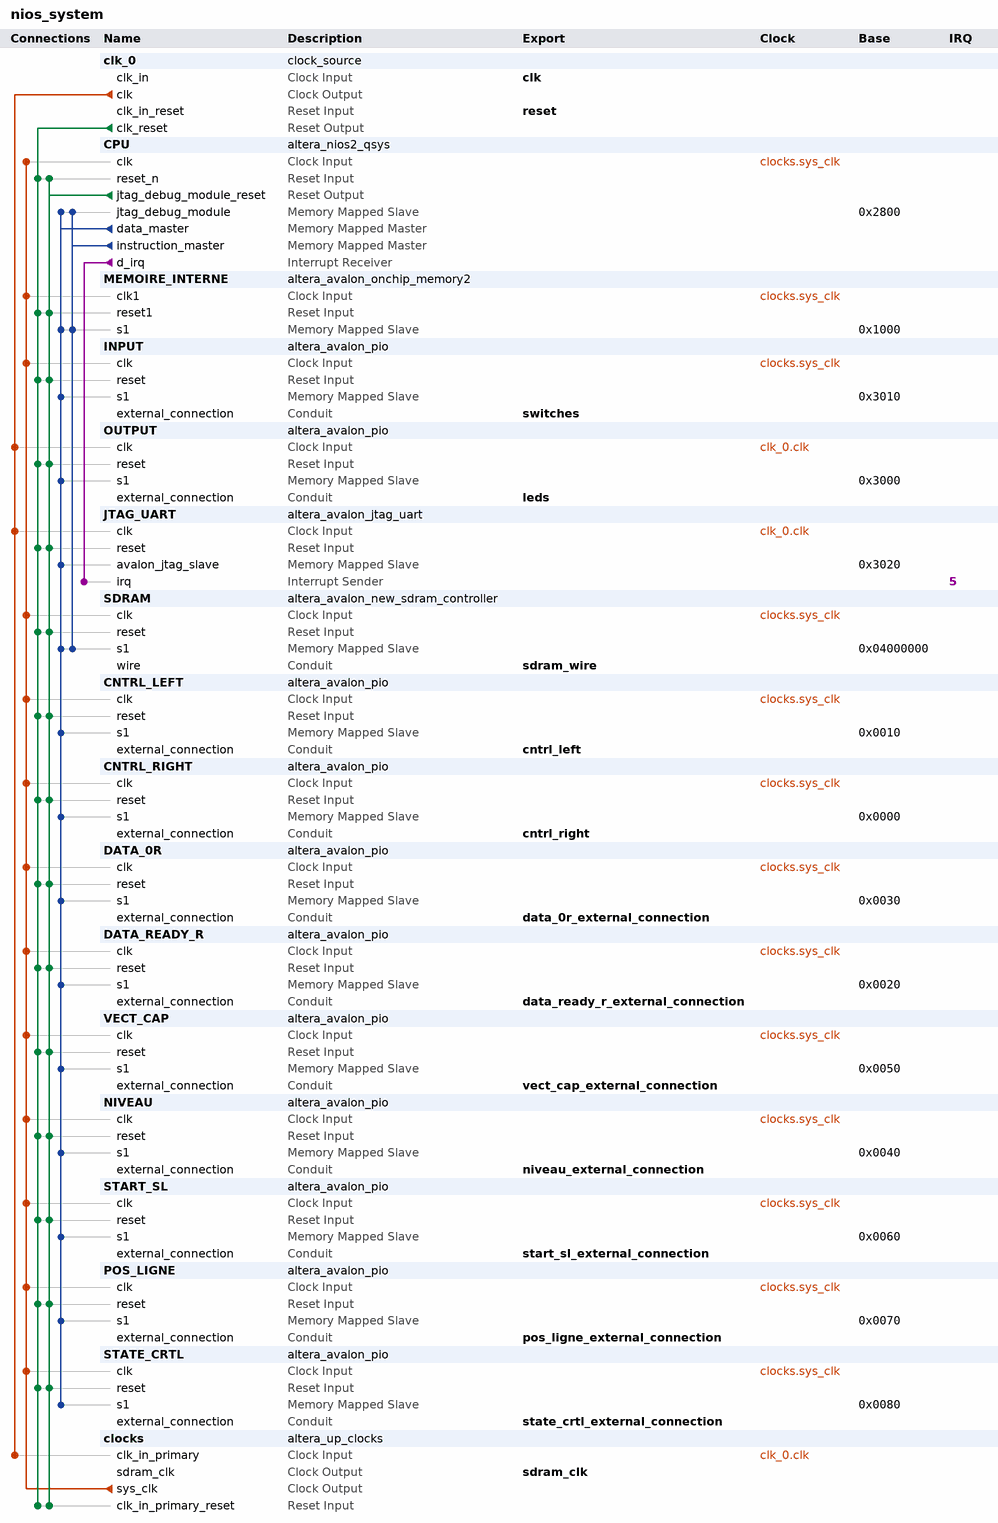
[diagram p0: system contents]
# Platform Designer (Qsys) system nios_system, Cyclone IV E EP4CE22F17C6
# Parameters at their usual value, and those the tool derives, are not listed.
package require -exact qsys 13.1
create_system nios_system
set_project_property DEVICE_FAMILY {Cyclone IV E}
set_project_property DEVICE EP4CE22F17C6

add_instance clk_0 clock_source 13.1
set_instance_parameter_value clk_0 clockFrequency 50000000

add_instance CPU altera_nios2_qsys 13.1
set_instance_parameter_value CPU resetSlave SDRAM.s1
set_instance_parameter_value CPU mmu_TLBMissExcSlave None
set_instance_parameter_value CPU exceptionSlave SDRAM.s1
set_instance_parameter_value CPU breakSlave CPU.jtag_debug_module
set_instance_parameter_value CPU impl Tiny
set_instance_parameter_value CPU icache_size 4096

add_instance MEMOIRE_INTERNE altera_avalon_onchip_memory2 13.1
set_instance_parameter_value MEMOIRE_INTERNE dataWidth 32
set_instance_parameter_value MEMOIRE_INTERNE dualPort false
set_instance_parameter_value MEMOIRE_INTERNE initMemContent true
set_instance_parameter_value MEMOIRE_INTERNE initializationFileName onchip_mem.hex
set_instance_parameter_value MEMOIRE_INTERNE memorySize 4096

add_instance INPUT altera_avalon_pio 13.1
set_instance_parameter_value INPUT direction Input
set_instance_parameter_value INPUT width 8

add_instance OUTPUT altera_avalon_pio 13.1
set_instance_parameter_value OUTPUT direction Output
set_instance_parameter_value OUTPUT width 8

add_instance JTAG_UART altera_avalon_jtag_uart 13.1
set_instance_parameter_value JTAG_UART simInteractiveOptions NO_INTERACTIVE_WINDOWS

add_instance SDRAM altera_avalon_new_sdram_controller 13.1
set_instance_parameter_value SDRAM TAC 5.5
set_instance_parameter_value SDRAM TRCD 20.0
set_instance_parameter_value SDRAM TRP 20.0
set_instance_parameter_value SDRAM casLatency 3
set_instance_parameter_value SDRAM columnWidth 9
set_instance_parameter_value SDRAM dataWidth 16
set_instance_parameter_value SDRAM generateSimulationModel false
set_instance_parameter_value SDRAM model single_Micron_MT48LC4M32B2_7_chip
set_instance_parameter_value SDRAM numberOfBanks 4
set_instance_parameter_value SDRAM numberOfChipSelects 1
set_instance_parameter_value SDRAM powerUpDelay 100.0
set_instance_parameter_value SDRAM refreshPeriod 15.625
set_instance_parameter_value SDRAM rowWidth 13

add_instance CNTRL_LEFT altera_avalon_pio 13.1
set_instance_parameter_value CNTRL_LEFT direction Output
set_instance_parameter_value CNTRL_LEFT width 16

add_instance CNTRL_RIGHT altera_avalon_pio 13.1
set_instance_parameter_value CNTRL_RIGHT direction Output
set_instance_parameter_value CNTRL_RIGHT width 16

add_instance DATA_0R altera_avalon_pio 13.1
set_instance_parameter_value DATA_0R direction Input
set_instance_parameter_value DATA_0R width 8

add_instance DATA_READY_R altera_avalon_pio 13.1
set_instance_parameter_value DATA_READY_R direction Input
set_instance_parameter_value DATA_READY_R width 1

add_instance VECT_CAP altera_avalon_pio 13.1
set_instance_parameter_value VECT_CAP direction Input
set_instance_parameter_value VECT_CAP width 7

add_instance NIVEAU altera_avalon_pio 13.1
set_instance_parameter_value NIVEAU direction Output
set_instance_parameter_value NIVEAU width 8

add_instance START_SL altera_avalon_pio 13.1
set_instance_parameter_value START_SL direction Output
set_instance_parameter_value START_SL width 1

add_instance POS_LIGNE altera_avalon_pio 13.1
set_instance_parameter_value POS_LIGNE direction Input
set_instance_parameter_value POS_LIGNE width 4

add_instance STATE_CRTL altera_avalon_pio 13.1
set_instance_parameter_value STATE_CRTL direction Input
set_instance_parameter_value STATE_CRTL width 2

add_instance clocks altera_up_clocks 13.0
set_instance_parameter_value clocks board DE0-Nano
set_instance_parameter_value clocks vga_clk false
set_instance_parameter_value clocks audio_clk false
set_instance_parameter_value clocks audio_clk_freq 12.288

# connections
add_connection clk_0.clk clocks.clk_in_primary clock
add_connection clk_0.clk JTAG_UART.clk clock
add_connection clk_0.clk OUTPUT.clk clock
add_connection clocks.sys_clk CNTRL_LEFT.clk clock
add_connection clocks.sys_clk CNTRL_RIGHT.clk clock
add_connection clocks.sys_clk CPU.clk clock
add_connection clocks.sys_clk DATA_0R.clk clock
add_connection clocks.sys_clk DATA_READY_R.clk clock
add_connection clocks.sys_clk INPUT.clk clock
add_connection clocks.sys_clk MEMOIRE_INTERNE.clk1 clock
add_connection clocks.sys_clk NIVEAU.clk clock
add_connection clocks.sys_clk POS_LIGNE.clk clock
add_connection clocks.sys_clk SDRAM.clk clock
add_connection clocks.sys_clk START_SL.clk clock
add_connection clocks.sys_clk STATE_CRTL.clk clock
add_connection clocks.sys_clk VECT_CAP.clk clock
add_connection clk_0.clk_reset clocks.clk_in_primary_reset reset
add_connection clk_0.clk_reset CNTRL_LEFT.reset reset
add_connection clk_0.clk_reset CNTRL_RIGHT.reset reset
add_connection clk_0.clk_reset CPU.reset_n reset
add_connection clk_0.clk_reset DATA_0R.reset reset
add_connection clk_0.clk_reset DATA_READY_R.reset reset
add_connection clk_0.clk_reset INPUT.reset reset
add_connection clk_0.clk_reset JTAG_UART.reset reset
add_connection clk_0.clk_reset MEMOIRE_INTERNE.reset1 reset
add_connection clk_0.clk_reset NIVEAU.reset reset
add_connection clk_0.clk_reset OUTPUT.reset reset
add_connection clk_0.clk_reset POS_LIGNE.reset reset
add_connection clk_0.clk_reset SDRAM.reset reset
add_connection clk_0.clk_reset START_SL.reset reset
add_connection clk_0.clk_reset STATE_CRTL.reset reset
add_connection clk_0.clk_reset VECT_CAP.reset reset
add_connection CPU.jtag_debug_module_reset clocks.clk_in_primary_reset reset
add_connection CPU.jtag_debug_module_reset CNTRL_LEFT.reset reset
add_connection CPU.jtag_debug_module_reset CNTRL_RIGHT.reset reset
add_connection CPU.jtag_debug_module_reset CPU.reset_n reset
add_connection CPU.jtag_debug_module_reset DATA_0R.reset reset
add_connection CPU.jtag_debug_module_reset DATA_READY_R.reset reset
add_connection CPU.jtag_debug_module_reset INPUT.reset reset
add_connection CPU.jtag_debug_module_reset JTAG_UART.reset reset
add_connection CPU.jtag_debug_module_reset MEMOIRE_INTERNE.reset1 reset
add_connection CPU.jtag_debug_module_reset NIVEAU.reset reset
add_connection CPU.jtag_debug_module_reset OUTPUT.reset reset
add_connection CPU.jtag_debug_module_reset POS_LIGNE.reset reset
add_connection CPU.jtag_debug_module_reset SDRAM.reset reset
add_connection CPU.jtag_debug_module_reset START_SL.reset reset
add_connection CPU.jtag_debug_module_reset STATE_CRTL.reset reset
add_connection CPU.jtag_debug_module_reset VECT_CAP.reset reset
add_connection CPU.data_master CNTRL_LEFT.s1 avalon
set_connection_parameter_value CPU.data_master/CNTRL_LEFT.s1 baseAddress 0x0010
add_connection CPU.data_master CNTRL_RIGHT.s1 avalon
set_connection_parameter_value CPU.data_master/CNTRL_RIGHT.s1 baseAddress 0x0000
add_connection CPU.data_master CPU.jtag_debug_module avalon
set_connection_parameter_value CPU.data_master/CPU.jtag_debug_module baseAddress 0x2800
add_connection CPU.data_master DATA_0R.s1 avalon
set_connection_parameter_value CPU.data_master/DATA_0R.s1 baseAddress 0x0030
add_connection CPU.data_master DATA_READY_R.s1 avalon
set_connection_parameter_value CPU.data_master/DATA_READY_R.s1 baseAddress 0x0020
add_connection CPU.data_master INPUT.s1 avalon
set_connection_parameter_value CPU.data_master/INPUT.s1 baseAddress 0x3010
add_connection CPU.data_master JTAG_UART.avalon_jtag_slave avalon
set_connection_parameter_value CPU.data_master/JTAG_UART.avalon_jtag_slave baseAddress 0x3020
add_connection CPU.data_master MEMOIRE_INTERNE.s1 avalon
set_connection_parameter_value CPU.data_master/MEMOIRE_INTERNE.s1 baseAddress 0x1000
add_connection CPU.data_master NIVEAU.s1 avalon
set_connection_parameter_value CPU.data_master/NIVEAU.s1 baseAddress 0x0040
add_connection CPU.data_master OUTPUT.s1 avalon
set_connection_parameter_value CPU.data_master/OUTPUT.s1 baseAddress 0x3000
add_connection CPU.data_master POS_LIGNE.s1 avalon
set_connection_parameter_value CPU.data_master/POS_LIGNE.s1 baseAddress 0x0070
add_connection CPU.data_master SDRAM.s1 avalon
set_connection_parameter_value CPU.data_master/SDRAM.s1 baseAddress 0x04000000
add_connection CPU.data_master START_SL.s1 avalon
set_connection_parameter_value CPU.data_master/START_SL.s1 baseAddress 0x0060
add_connection CPU.data_master STATE_CRTL.s1 avalon
set_connection_parameter_value CPU.data_master/STATE_CRTL.s1 baseAddress 0x0080
add_connection CPU.data_master VECT_CAP.s1 avalon
set_connection_parameter_value CPU.data_master/VECT_CAP.s1 baseAddress 0x0050
add_connection CPU.instruction_master CPU.jtag_debug_module avalon
set_connection_parameter_value CPU.instruction_master/CPU.jtag_debug_module baseAddress 0x2800
add_connection CPU.instruction_master MEMOIRE_INTERNE.s1 avalon
set_connection_parameter_value CPU.instruction_master/MEMOIRE_INTERNE.s1 baseAddress 0x1000
add_connection CPU.instruction_master SDRAM.s1 avalon
set_connection_parameter_value CPU.instruction_master/SDRAM.s1 baseAddress 0x04000000
add_connection CPU.d_irq JTAG_UART.irq interrupt
set_connection_parameter_value CPU.d_irq/JTAG_UART.irq irqNumber 5

# exported interfaces
add_interface clk clock sink
set_interface_property clk EXPORT_OF clk_0.clk_in
add_interface reset reset sink
set_interface_property reset EXPORT_OF clk_0.clk_in_reset
add_interface switches conduit end
set_interface_property switches EXPORT_OF INPUT.external_connection
add_interface leds conduit end
set_interface_property leds EXPORT_OF OUTPUT.external_connection
add_interface sdram_wire conduit end
set_interface_property sdram_wire EXPORT_OF SDRAM.wire
add_interface cntrl_left conduit end
set_interface_property cntrl_left EXPORT_OF CNTRL_LEFT.external_connection
add_interface cntrl_right conduit end
set_interface_property cntrl_right EXPORT_OF CNTRL_RIGHT.external_connection
add_interface data_0r_external_connection conduit end
set_interface_property data_0r_external_connection EXPORT_OF DATA_0R.external_connection
add_interface data_ready_r_external_connection conduit end
set_interface_property data_ready_r_external_connection EXPORT_OF DATA_READY_R.external_connection
add_interface vect_cap_external_connection conduit end
set_interface_property vect_cap_external_connection EXPORT_OF VECT_CAP.external_connection
add_interface niveau_external_connection conduit end
set_interface_property niveau_external_connection EXPORT_OF NIVEAU.external_connection
add_interface start_sl_external_connection conduit end
set_interface_property start_sl_external_connection EXPORT_OF START_SL.external_connection
add_interface pos_ligne_external_connection conduit end
set_interface_property pos_ligne_external_connection EXPORT_OF POS_LIGNE.external_connection
add_interface state_crtl_external_connection conduit end
set_interface_property state_crtl_external_connection EXPORT_OF STATE_CRTL.external_connection
add_interface sdram_clk clock source
set_interface_property sdram_clk EXPORT_OF clocks.sdram_clk

set_interconnect_requirement {$system} qsys_mm.clockCrossingAdapter HANDSHAKE
set_interconnect_requirement {$system} qsys_mm.maxAdditionalLatency 1

save_system nios_system.qsys
